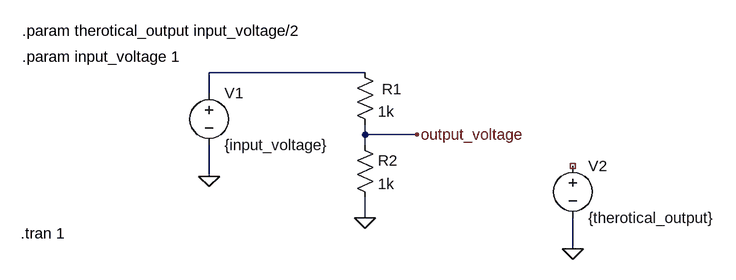
[diagram p0: schematic L3 B.asc]
L3 B.asc, the LTspice schematic file:
Version 4
SHEET 1 916 680
WIRE 336 80 96 80
WIRE 96 112 96 80
WIRE 336 176 336 160
WIRE 416 176 336 176
WIRE 336 192 336 176
WIRE 96 240 96 192
WIRE 336 304 336 272
WIRE 656 352 656 304
FLAG 96 240 0
FLAG 336 304 0
FLAG 416 176 output_voltage
FLAG 656 352 0
SYMBOL res 320 64 R0
WINDOW 0 42 42 Left 2
SYMATTR InstName R1
SYMATTR Value 1k
SYMBOL res 320 176 R0
SYMATTR InstName R2
SYMATTR Value 1k
SYMBOL voltage 96 96 R0
WINDOW 123 0 0 Left 0
WINDOW 39 0 0 Left 0
SYMATTR InstName V1
SYMATTR Value {input_voltage}
SYMBOL voltage 656 208 R0
WINDOW 123 0 0 Left 0
WINDOW 39 0 0 Left 0
SYMATTR InstName V2
SYMATTR Value {therotical_output}
TEXT -192 56 Left 2 !.param input_voltage 1
TEXT -192 16 Left 2 !.param therotical_output input_voltage/2
TEXT -194 328 Left 2 !.tran 1

The netlist it stands for:
* L3 B.asc
R1 N001 output_voltage 1k
R2 output_voltage 0 1k
V1 N001 0 {input_voltage}
V2 NC_01 0 {therotical_output}
.param input_voltage 1
.param therotical_output input_voltage/2
.tran 1
.backanno
.end